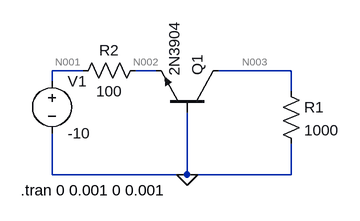
[diagram p0: schematic CB_mode.asc]
CB_mode.asc, the LTspice schematic file:
Version 4
SHEET 1 880 680
WIRE 32 96 -16 96
WIRE 144 96 112 96
WIRE 352 96 240 96
WIRE -16 112 -16 96
WIRE 352 128 352 96
WIRE -16 256 -16 192
WIRE 192 256 192 160
WIRE 192 256 -16 256
WIRE 352 256 352 208
WIRE 352 256 192 256
FLAG 192 256 0
SYMBOL npn 240 160 M270
SYMATTR InstName Q1
SYMATTR Value 2N3904
SYMBOL res 336 112 R0
SYMATTR InstName R1
SYMATTR Value 1000
SYMBOL voltage -16 96 R0
WINDOW 123 0 0 Left 2
WINDOW 39 0 0 Left 2
SYMATTR InstName V1
SYMATTR Value -10
SYMBOL res 16 112 R270
WINDOW 0 32 56 VTop 2
WINDOW 3 0 56 VBottom 2
SYMATTR InstName R2
SYMATTR Value 100
TEXT -64 280 Left 2 !.tran 0 0.001 0 0.001

The netlist it stands for:
* CB_mode.asc
Q1 N003 0 N002 0 2N3904
R1 N003 0 1000
V1 N001 0 -10
R2 N001 N002 100
.model NPN NPN
.model PNP PNP
.lib standard.bjt
.tran 0 0.001 0 0.001
.backanno
.end

* Results of the author's LTspice run, read from the files saved beside the schematic
* Operating Point, zero values left out:
*   V(n003) = -2.294 V
*   V(n002) = -2.311 V
*   V(n001) = -10 V
*   Ic(Q1) = 2.294 mA
*   Ib(Q1) = 74.6 mA
*   Ie(Q1) = -76.89 mA
*   I(R2) = -76.89 mA
*   I(R1) = -2.294 mA
*   I(V1) = 76.89 mA
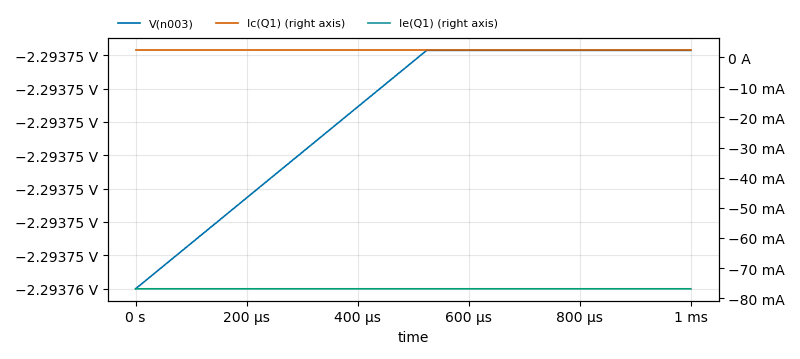
[diagram p1: Transient Analysis of CB_mode.asc, plotted from the saved traces]
* Transient Analysis, 1 run:
*   V(n003): min -2.294 V, max -2.294 V, average -2.294 V, rms 2.294 V, last -2.294 V
*   Ic(Q1): min 2.294 mA, max 2.294 mA, average 2.294 mA, rms 2.294 mA, last 2.294 mA
*   Ie(Q1): min -76.89 mA, max -76.89 mA, average -76.89 mA, rms 76.89 mA, last -76.89 mA